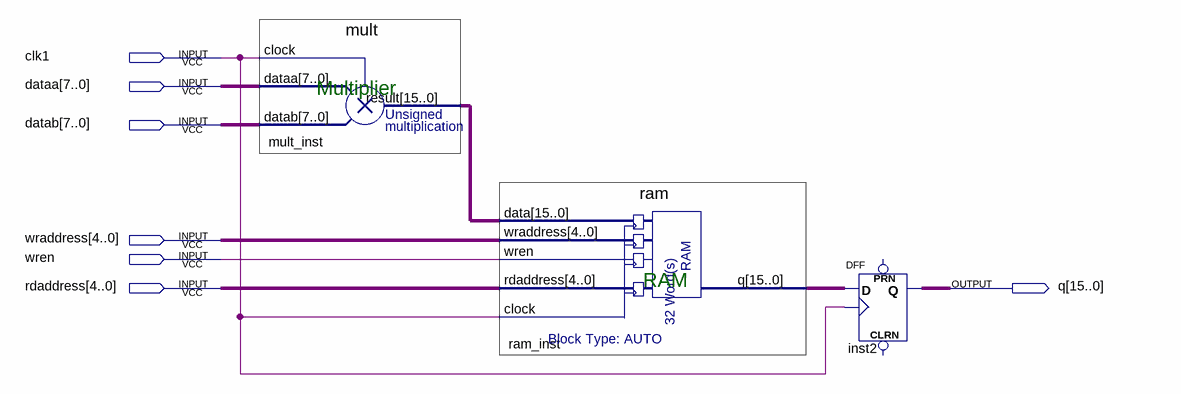
[diagram p0: schematic sheet]
// Quartus schematic pipemult.bdf as structural Verilog: 3 symbols, 7 pins
module pipemult (
  input  clk1,
  input  [7:0] dataa,
  input  [7:0] datab,
  input  [4:0] wraddress,
  input  wren,
  input  [4:0] rdaddress,
  output [15:0] q
);

  wire [15:0] mult_inst_result, ram_inst_q;

  mult mult_inst (.dataa(dataa), .datab(datab), .clock(clk1), .result(mult_inst_result));
  ram ram_inst (
    .data(mult_inst_result), .wraddress(wraddress), .wren(wren), .rdaddress(rdaddress), .clock(clk1),
    .q(ram_inst_q));
  DFF inst2[15:0] (.CLK(clk1), .D(ram_inst_q), .Q(q));  // open: CLRN, PRN

  // Notes on the sheet:
  //   Multiplier
  //   RAM
endmodule
